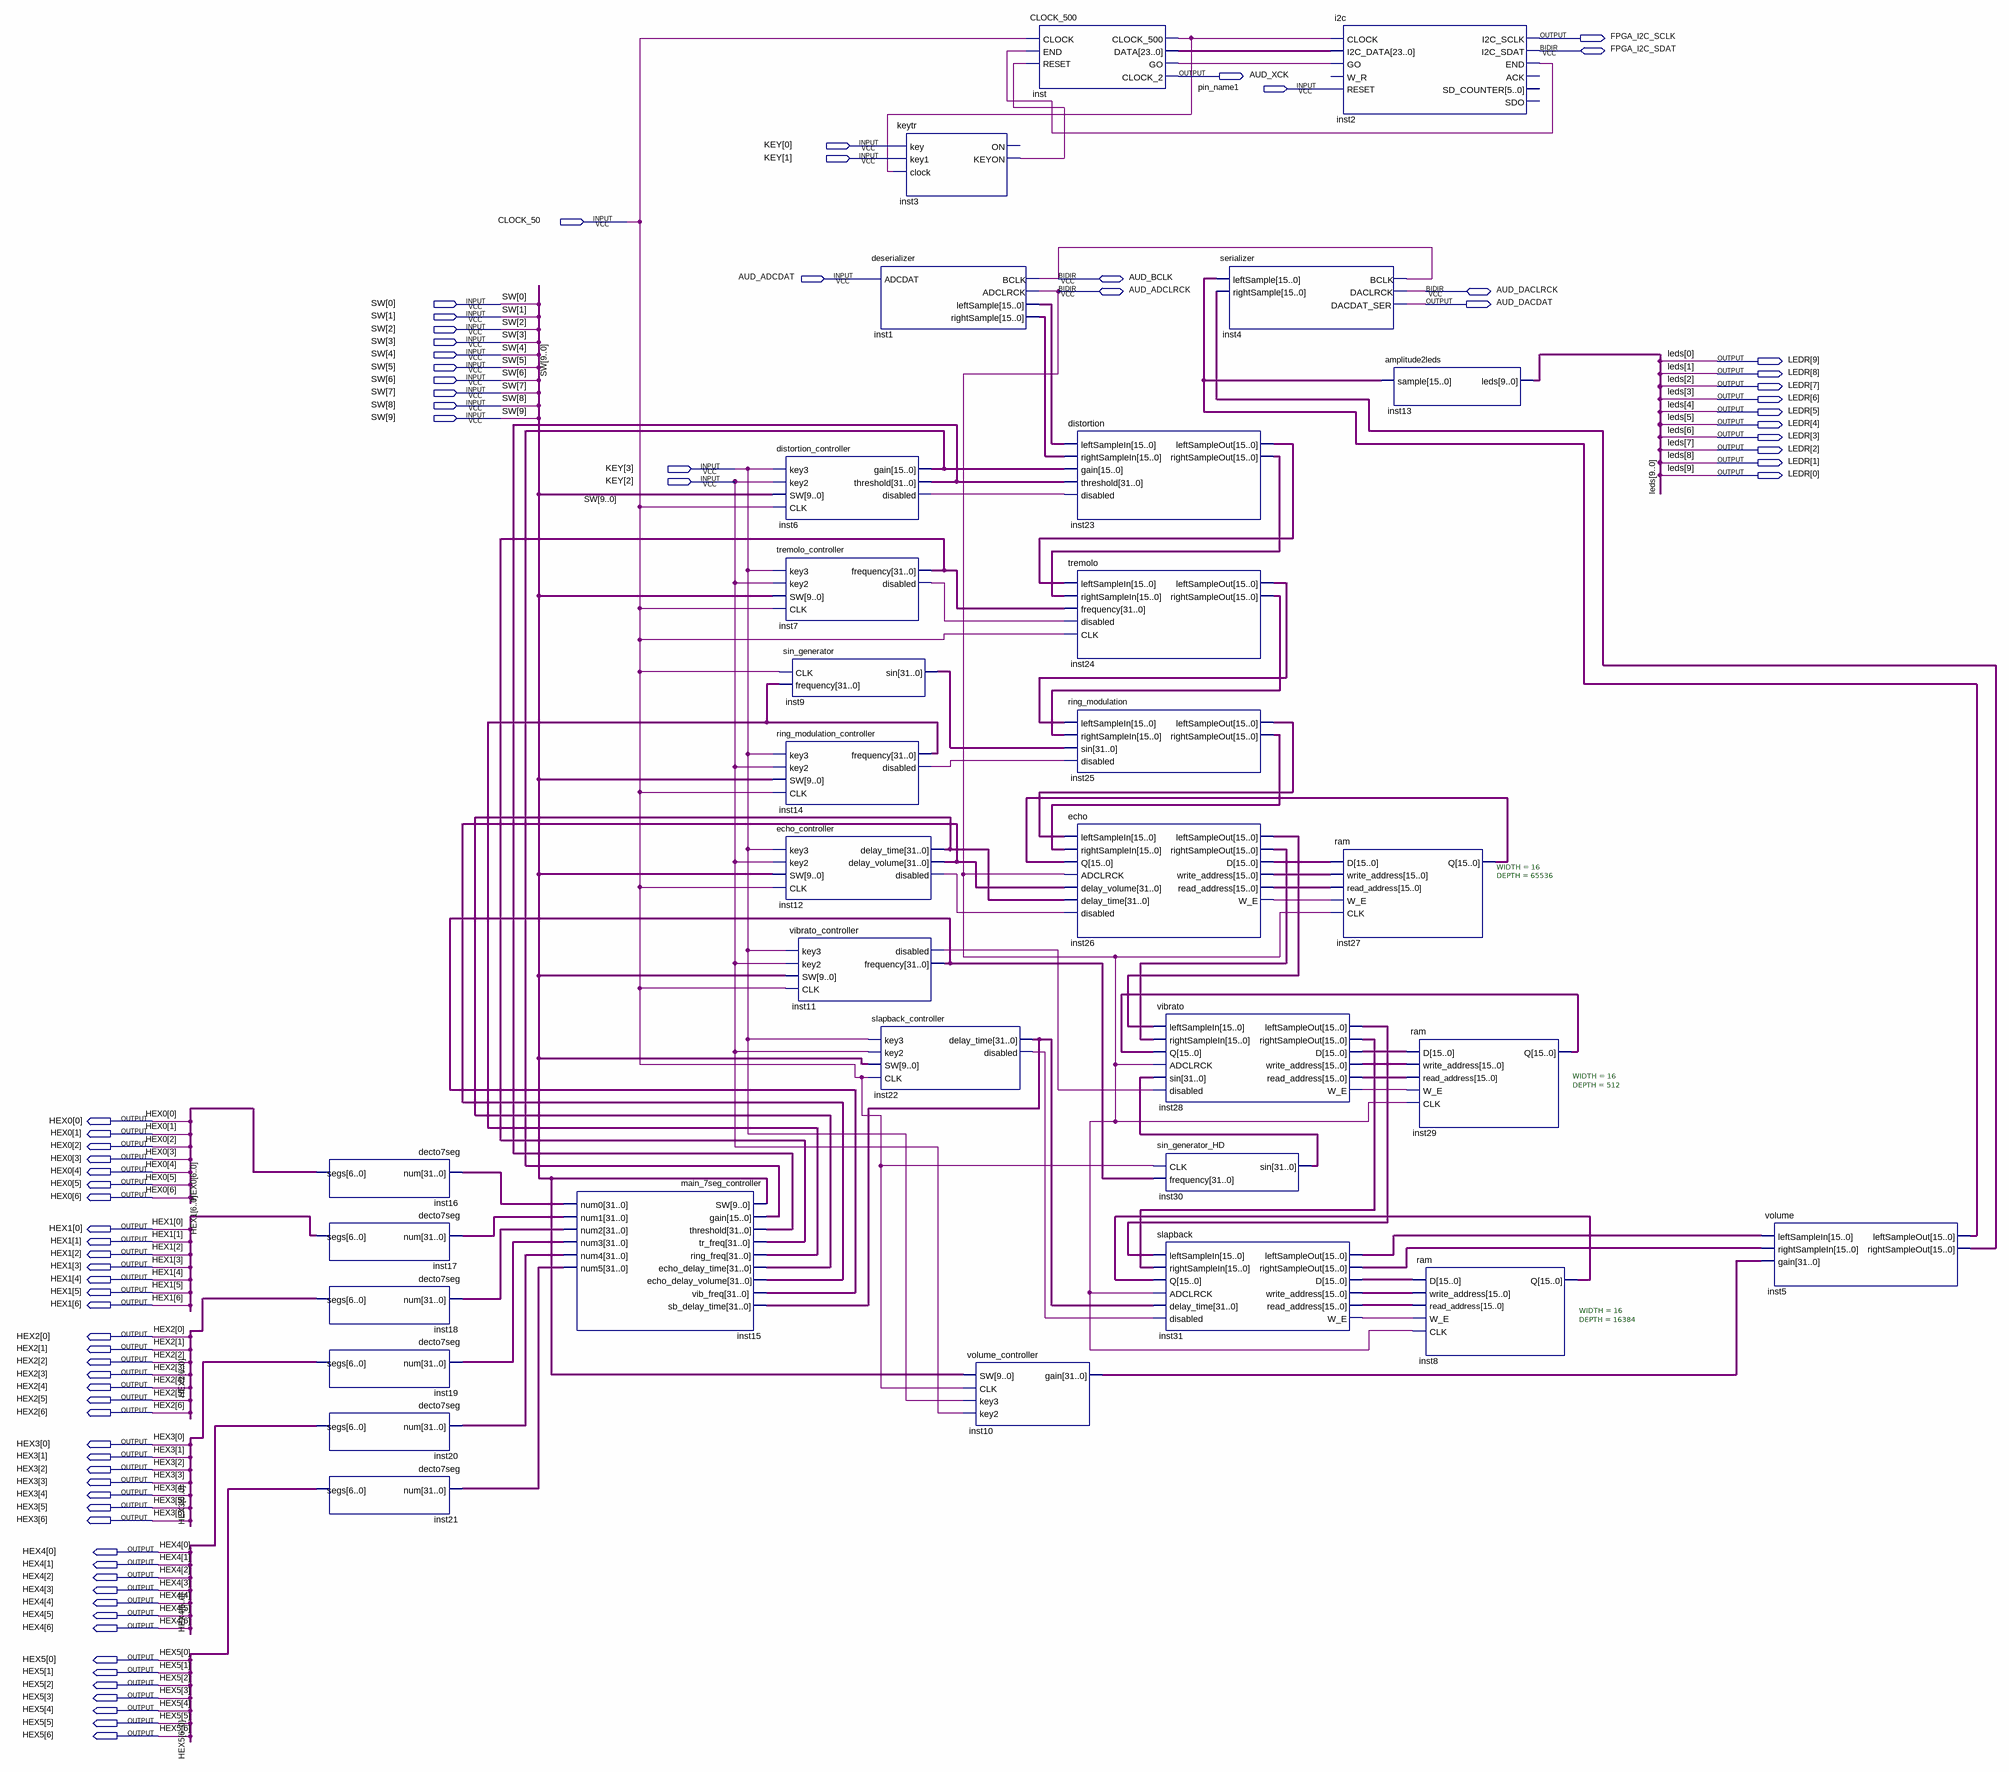
[diagram p0: schematic sheet]
// Quartus schematic main.bdf as structural Verilog: 32 symbols, 76 pins
module main (
  input  pin_name1,
  input  [3:0] KEY,
  input  CLOCK_50,
  input  AUD_ADCDAT,
  input  [9:0] SW,
  inout  FPGA_I2C_SDAT,
  inout  AUD_BCLK,
  inout  AUD_ADCLRCK,
  inout  AUD_DACLRCK,
  output FPGA_I2C_SCLK,
  output AUD_XCK,
  output AUD_DACDAT,
  output [9:0] LEDR,
  output [6:0] HEX0,
  output [6:0] HEX1,
  output [6:0] HEX2,
  output [6:0] HEX3,
  output [6:0] HEX4,
  output [6:0] HEX5
);

  wire inst2_end, inst3_keyon, inst6_disabled, inst7_disabled, inst11_disabled, inst12_disabled,
       inst14_disabled, inst22_disabled, inst26_w_e, inst28_w_e, inst31_w_e, inst_clock_500, inst_go;
  wire [15:0] inst1_leftsample, inst1_rightsample, inst5_leftsampleout, inst5_rightsampleout, inst6_gain,
       inst8_q, inst23_leftsampleout, inst23_rightsampleout, inst24_leftsampleout, inst24_rightsampleout,
       inst25_leftsampleout, inst25_rightsampleout, inst26_d, inst26_leftsampleout, inst26_read_address,
       inst26_rightsampleout, inst26_write_address, inst27_q, inst28_d, inst28_leftsampleout,
       inst28_read_address, inst28_rightsampleout, inst28_write_address, inst29_q, inst31_d,
       inst31_leftsampleout, inst31_read_address, inst31_rightsampleout, inst31_write_address;
  wire [23:0] inst_data;
  wire [31:0] inst6_threshold, inst7_frequency, inst9_sin, inst10_gain, inst11_frequency, inst12_delay_time,
       inst12_delay_volume, inst14_frequency, inst15_num0, inst15_num1, inst15_num2, inst15_num3,
       inst15_num4, inst15_num5, inst22_delay_time, inst30_sin;

  decto7seg inst16 (.num(inst15_num0), .segs(HEX0));
  decto7seg inst17 (.num(inst15_num1), .segs(HEX1));
  decto7seg inst18 (.num(inst15_num2), .segs(HEX2));
  decto7seg inst19 (.num(inst15_num3), .segs(HEX3));
  decto7seg inst20 (.num(inst15_num4), .segs(HEX4));
  decto7seg inst21 (.num(inst15_num5), .segs(HEX5));
  main_7seg_controller inst15 (
    .SW(SW), .gain(inst6_gain), .threshold(inst6_threshold), .tr_freq(inst7_frequency),
    .ring_freq(inst14_frequency), .echo_delay_time(inst12_delay_time),
    .echo_delay_volume(inst12_delay_volume), .vib_freq(inst11_frequency), .sb_delay_time(inst22_delay_time),
    .num0(inst15_num0), .num1(inst15_num1), .num2(inst15_num2), .num3(inst15_num3), .num4(inst15_num4),
    .num5(inst15_num5));
  distortion_controller inst6 (
    .key3(KEY[3]), .key2(KEY[2]), .SW(SW), .CLK(CLOCK_50), .gain(inst6_gain), .threshold(inst6_threshold),
    .disabled(inst6_disabled));
  tremolo_controller inst7 (
    .key3(KEY[3]), .key2(KEY[2]), .SW(SW), .CLK(CLOCK_50), .frequency(inst7_frequency),
    .disabled(inst7_disabled));
  sin_generator inst9 (.CLK(CLOCK_50), .frequency(inst14_frequency), .sin(inst9_sin));
  ring_modulation_controller inst14 (
    .key3(KEY[3]), .key2(KEY[2]), .SW(SW), .CLK(CLOCK_50), .frequency(inst14_frequency),
    .disabled(inst14_disabled));
  echo_controller inst12 (
    .key3(KEY[3]), .key2(KEY[2]), .SW(SW), .CLK(CLOCK_50), .delay_time(inst12_delay_time),
    .delay_volume(inst12_delay_volume), .disabled(inst12_disabled));
  vibrato_controller inst11 (
    .key3(KEY[3]), .key2(KEY[2]), .SW(SW), .CLK(CLOCK_50), .disabled(inst11_disabled),
    .frequency(inst11_frequency));
  keytr inst3 (.key(KEY[0]), .key1(KEY[1]), .clock(inst_clock_500), .KEYON(inst3_keyon));  // open: ON
  deserializer inst1 (
    .ADCDAT(AUD_ADCDAT), .leftSample(inst1_leftsample), .rightSample(inst1_rightsample), .BCLK(AUD_BCLK),
    .ADCLRCK(AUD_ADCLRCK));
  slapback_controller inst22 (
    .key3(KEY[3]), .key2(KEY[2]), .SW(SW), .CLK(CLOCK_50), .delay_time(inst22_delay_time),
    .disabled(inst22_disabled));
  volume_controller inst10 (.SW(SW), .CLK(CLOCK_50), .key3(KEY[3]), .key2(KEY[2]), .gain(inst10_gain));
  CLOCK_500 inst (
    .CLOCK(CLOCK_50), .END(inst2_end), .RESET(inst3_keyon), .CLOCK_500(inst_clock_500), .DATA(inst_data),
    .GO(inst_go), .CLOCK_2(AUD_XCK));
  distortion inst23 (
    .leftSampleIn(inst1_leftsample), .rightSampleIn(inst1_rightsample), .gain(inst6_gain),
    .threshold(inst6_threshold), .disabled(inst6_disabled), .leftSampleOut(inst23_leftsampleout),
    .rightSampleOut(inst23_rightsampleout));
  tremolo inst24 (
    .leftSampleIn(inst23_leftsampleout), .rightSampleIn(inst23_rightsampleout), .frequency(inst7_frequency),
    .disabled(inst7_disabled), .CLK(CLOCK_50), .leftSampleOut(inst24_leftsampleout),
    .rightSampleOut(inst24_rightsampleout));
  ring_modulation inst25 (
    .leftSampleIn(inst24_leftsampleout), .rightSampleIn(inst24_rightsampleout), .sin(inst9_sin),
    .disabled(inst14_disabled), .leftSampleOut(inst25_leftsampleout), .rightSampleOut(inst25_rightsampleout));
  echo inst26 (
    .leftSampleIn(inst25_leftsampleout), .rightSampleIn(inst25_rightsampleout), .Q(inst27_q),
    .ADCLRCK(AUD_ADCLRCK), .delay_volume(inst12_delay_volume), .delay_time(inst12_delay_time),
    .disabled(inst12_disabled), .leftSampleOut(inst26_leftsampleout), .rightSampleOut(inst26_rightsampleout),
    .D(inst26_d), .write_address(inst26_write_address), .read_address(inst26_read_address), .W_E(inst26_w_e));
  vibrato inst28 (
    .leftSampleIn(inst26_leftsampleout), .rightSampleIn(inst26_rightsampleout), .Q(inst29_q),
    .ADCLRCK(AUD_ADCLRCK), .sin(inst30_sin), .disabled(inst11_disabled),
    .leftSampleOut(inst28_leftsampleout), .rightSampleOut(inst28_rightsampleout), .D(inst28_d),
    .write_address(inst28_write_address), .read_address(inst28_read_address), .W_E(inst28_w_e));
  sin_generator_HD inst30 (.CLK(CLOCK_50), .frequency(inst11_frequency), .sin(inst30_sin));
  slapback inst31 (
    .leftSampleIn(inst28_leftsampleout), .rightSampleIn(inst28_rightsampleout), .Q(inst8_q),
    .ADCLRCK(AUD_ADCLRCK), .delay_time(inst22_delay_time), .disabled(inst22_disabled),
    .leftSampleOut(inst31_leftsampleout), .rightSampleOut(inst31_rightsampleout), .D(inst31_d),
    .write_address(inst31_write_address), .read_address(inst31_read_address), .W_E(inst31_w_e));
  serializer inst4 (
    .leftSample(inst5_leftsampleout), .rightSample(inst5_rightsampleout), .DACDAT_SER(AUD_DACDAT),
    .BCLK(AUD_BCLK), .DACLRCK(AUD_DACLRCK));
  i2c inst2 (
    .CLOCK(inst_clock_500), .I2C_DATA(inst_data), .GO(inst_go), .RESET(pin_name1), .I2C_SCLK(FPGA_I2C_SCLK),
    .END(inst2_end), .I2C_SDAT(FPGA_I2C_SDAT));  // open: W_R, ACK, SD_COUNTER, SDO
  ram #(.WIDTH(16), .DEPTH(65536)) inst27 (
    .D(inst26_d), .write_address(inst26_write_address), .read_address(inst26_read_address), .W_E(inst26_w_e),
    .CLK(AUD_ADCLRCK), .Q(inst27_q));
  amplitude2leds inst13 (
    .sample(inst5_leftsampleout),
    .leds({LEDR[0], LEDR[1], LEDR[2], LEDR[3], LEDR[4], LEDR[5], LEDR[6], LEDR[7], LEDR[8], LEDR[9]}));
  ram #(.WIDTH(16), .DEPTH(512)) inst29 (
    .D(inst28_d), .write_address(inst28_write_address), .read_address(inst28_read_address), .W_E(inst28_w_e),
    .CLK(AUD_ADCLRCK), .Q(inst29_q));
  ram #(.WIDTH(16), .DEPTH(16384)) inst8 (
    .D(inst31_d), .write_address(inst31_write_address), .read_address(inst31_read_address), .W_E(inst31_w_e),
    .CLK(AUD_ADCLRCK), .Q(inst8_q));
  volume inst5 (
    .leftSampleIn(inst31_leftsampleout), .rightSampleIn(inst31_rightsampleout), .gain(inst10_gain),
    .leftSampleOut(inst5_leftsampleout), .rightSampleOut(inst5_rightsampleout));

  // Other names for the same wires on the sheet: leds[9:0] = {LEDR[0], LEDR[1], LEDR[2], LEDR[3], LEDR[4], LEDR[5], LEDR[6], LEDR[7], LEDR[8], LEDR[9]}
endmodule
